# Altium project 03-425A-01A.PrjPcb (part 2 of 3)

## Sheet 425AK01A_S02.SchDoc
size A3; DocumentNumber: 2; SheetNumber: 2; SheetTotal: 10; PageSetup: Record=PageOptions|CenterHorizontal=True|CenterVertical=True|PrintScale=1.01|XCorrection=1.00|YCorrection=1.00|PrintKind=1|BorderSize=5000000|LeftOffset=0|BottomOffset=0|Orientation=2|PaperLength=1000|PaperWidth=1000|Scale=100|PaperSource=15|PrintQuality=600|MediaType=1|DitherType=10|PaperKind=A3|PrintScaleMode=1; 00_Rev: D; 00_Drawn: RJG; 00_Date: 8APR2022; 00_Checked: SR; 00_Approved: GN; 00_Line2: 100MHz Reference Select Board; 00_Line3: M4 ADS; 00_Line1: Microcontroller
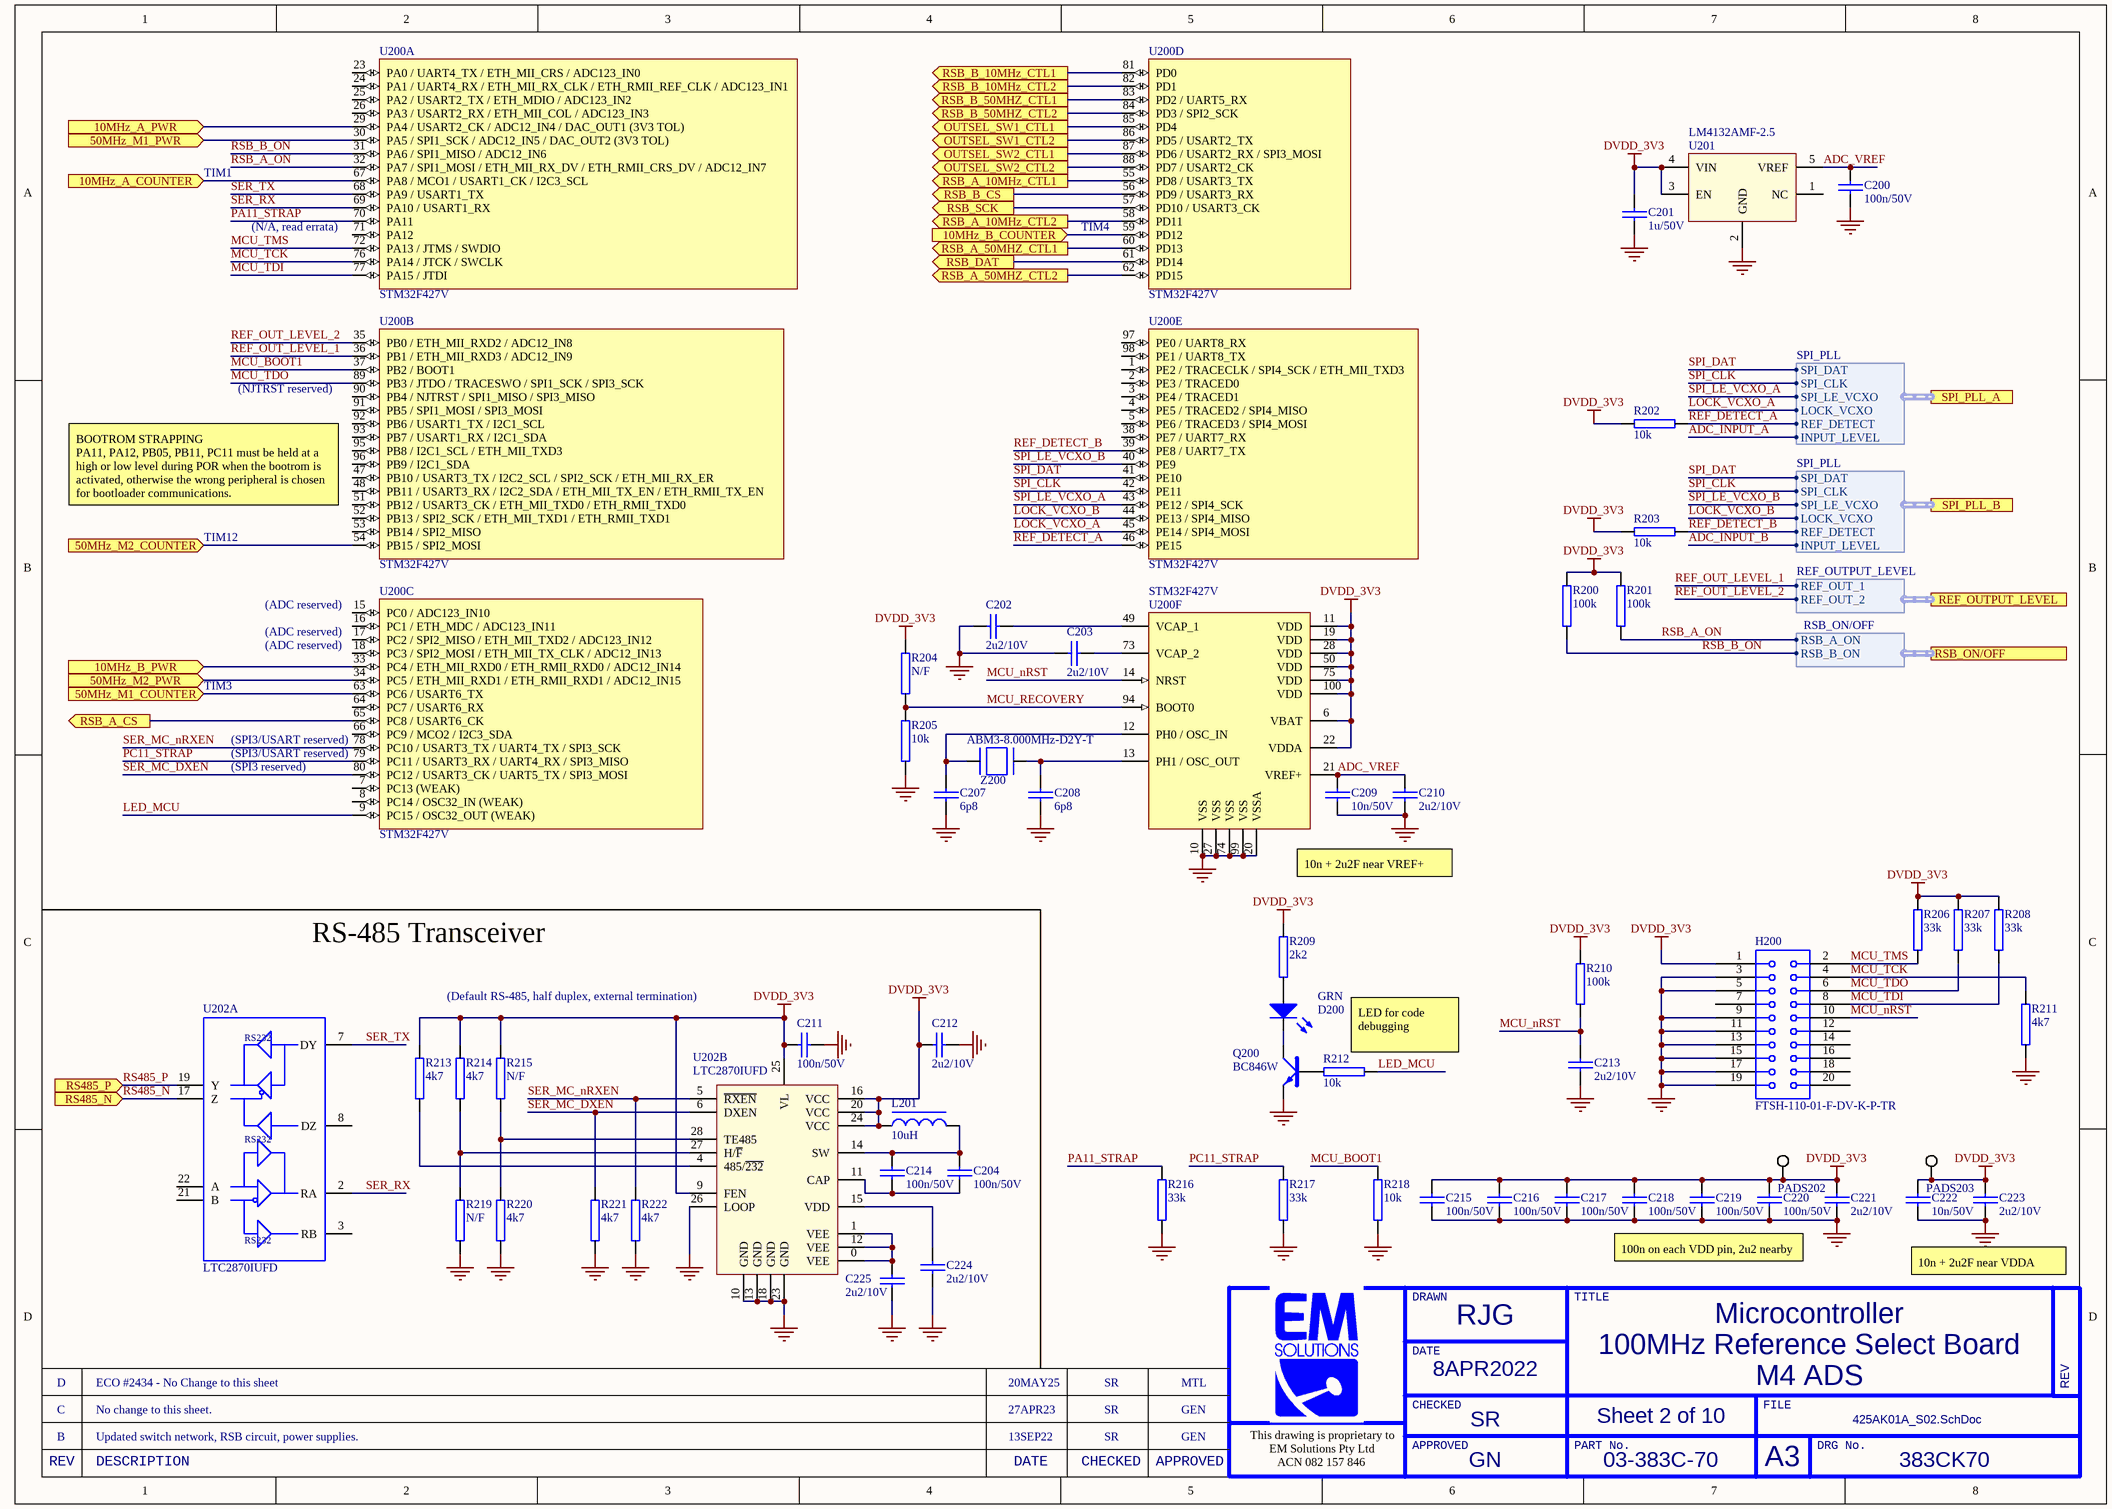
[diagram p4: 425AK01A_S02.SchDoc]

### Parts
C200  100n/50V  [0402C]
C201  1u/50V  [0603C]
C202  2u2/10V  [0603C]
C203  2u2/10V  [0603C]
C204  100n/50V  [0402C]
C207  6p8  [0402C]
C208  6p8  [0402C]
C209  10n/50V  [0402C]
C210  2u2/10V  [0603C]
C211  100n/50V  [0402C]
C212  2u2/10V  [0603C]
C213  2u2/10V  [0603C]
C214  100n/50V  [0402C]
C215  100n/50V  [0402C]
C216  100n/50V  [0402C]
C217  100n/50V  [0402C]
C218  100n/50V  [0402C]
C219  100n/50V  [0402C]
C220  100n/50V  [0402C]
C221  2u2/10V  [0603C]
C222  10n/50V  [0402C]
C223  2u2/10V  [0603C]
C224  2u2/10V  [0603C]
C225  2u2/10V  [0603C]
D200  GRN  [0603 LED]
H200  FTSH-110-01-F-DV-K-P-TR  [FTSH-110-01-F-DV-K]
L201  10uH  [0805L]
PADS202  Pads  [Pads-1x3-V3-0.3/0.6mm]  (value not drawn)  (net tie, no BOM)
PADS203  Pads  [Pads-1x3-V3-0.3/0.6mm]  (value not drawn)  (net tie, no BOM)
Q200  BC846W  [SOT-323BJT]
R200  100k  [0402]
R201  100k  [0402]
R202  10k  [0402]
R203  10k  [0402]
R204  N/F  [0402]
R205  10k  [0402]
R206  33k  [0402]
R207  33k  [0402]
R208  33k  [0402]
R209  2k2  [0402]
R210  100k  [0402]
R211  4k7  [0402]
R212  10k  [0402]
R213  4k7  [0402]
R214  4k7  [0402]
R215  N/F  [0402]
R216  33k  [0402]
R217  33k  [0402]
R218  10k  [0402]
R219  N/F  [0402]
R220  4k7  [0402]
R221  4k7  [0402]
R222  4k7  [0402]
U200  STM32F427V  [LQFP100]  (parts A,B,C,D,E,F of 6)
U201  LM4132AMF-2.5  [SOT-23/5]
U202  LTC2870IUFD  [QFN-28 4x5mm]  (parts A,B of 2)
Z200  ABM3-8.000MHz-D2Y-T  [ABM3]

### Ports
10MHz_A_COUNTER (in), 10MHz_A_PWR (in), 10MHz_B_COUNTER (in), 10MHz_B_PWR (in), 50MHz_M1_COUNTER (in), 50MHz_M1_PWR (in), 50MHz_M2_COUNTER (in), 50MHz_M2_PWR (in), OUTSEL_SW1_CTL1 (out), OUTSEL_SW1_CTL2 (out), OUTSEL_SW2_CTL1 (out), OUTSEL_SW2_CTL2 (out), REF_OUTPUT_LEVEL (harness REF_OUTPUT_LEVEL), RS485_N (in), RS485_P (in), RSB_A_10MHz_CTL1 (out), RSB_A_10MHz_CTL2 (out), RSB_A_50MHZ_CTL1 (out), RSB_A_50MHZ_CTL2 (out), RSB_A_CS (out), RSB_B_10MHz_CTL1 (out), RSB_B_10MHz_CTL2 (out), RSB_B_50MHZ_CTL1 (out), RSB_B_50MHZ_CTL2 (out), RSB_B_CS (out), RSB_DAT (out), RSB_ON/OFF (harness RSB_ON/OFF), RSB_SCK (out), SPI_PLL_A (harness SPI_PLL), SPI_PLL_B (harness SPI_PLL)

### Harnesses
SPI_PLL: SPI_LE_VCXO, SPI_CLK, SPI_DAT, REF_DETECT, LOCK_VCXO, INPUT_LEVEL
REF_OUTPUT_LEVEL: REF_OUT_1, REF_OUT_2
RSB_ON/OFF: RSB_A_ON, RSB_B_ON

### Nets
DVDD_3V3: C201.1 C211.1 C212.1 C215.1 C216.1 C217.1 C218.1 C219.1 C220.1 C221.1 C222.1 C223.1 H200.1 L201.1 PADS202.1 PADS203.1 R200.2 R201.2 R202.2 R203.2 R204.2 R206.2 R207.2 R208.2 R209.2 R210.2 R213.2 R214.2 R215.2 U200.6(VBAT) U200.11(VDD) U200.19(VDD) U200.22(VDDA) U200.28(VDD) U200.50(VDD) U200.75(VDD) U200.100(VDD) U201.3(EN) U201.4(VIN) U202.9(FEN) U202.16(VCC) U202.20(VCC) U202.24(VCC) U202.25(VL)
GND: C200.1 C201.2 C202.1 C203.2 C207.2 C208.2 C209.2 C210.2 C211.2 C212.2 C213.2 C215.2 C216.2 C217.2 C218.2 C219.2 C220.2 C221.2 C222.2 C223.2 C224.2 C225.2 H200.3 H200.5 H200.9 H200.11 H200.13 H200.15 H200.17 H200.19 Q200.E R205.1 R211.1 R216.1 R217.1 R218.1 R219.1 R220.1 R221.2 R222.1 U200.10(VSS) U200.20(VSSA) U200.27(VSS) U200.74(VSS) U200.99(VSS) U201.2(GND) U202.10(GND) U202.13(GND) U202.18(GND) U202.23(GND) U202.26(LOOP)
ADC_INPUT_A: port SPI_PLL_A.INPUT_LEVEL
ADC_INPUT_B: port SPI_PLL_B.INPUT_LEVEL
ADC_VREF: C200.2 C209.1 C210.1 U200.21(VREF+) U201.5(VREF)
LED_MCU: R212.1 U200.9(PC15_/_OSC32_OUT_(WEAK))
LOCK_VCXO_A: U200.45(PE14_/_SPI4_MOSI) ; port SPI_PLL_A.LOCK_VCXO
LOCK_VCXO_B: U200.44(PE13_/_SPI4_MISO) ; port SPI_PLL_B.LOCK_VCXO
MCU_BOOT1: R218.2 U200.37(PB2_/_BOOT1)
MCU_nRST: C213.1 H200.10 R210.1 U200.14(NRST)
MCU_RECOVERY: R204.1 R205.2 U200.94(BOOT0)
MCU_TCK: H200.4 R211.2 U200.76(PA14_/_JTCK_/_SWCLK)
MCU_TDI: H200.8 R208.1 U200.77(PA15_/_JTDI)
MCU_TDO: H200.6 R207.1 U200.89(PB3_/_JTDO_/_TRACESWO_/_SPI1_SCK_/_SPI3_SCK)
MCU_TMS: H200.2 R206.1 U200.72(PA13_/_JTMS_/_SWDIO)
PA11_STRAP: R216.2 U200.70(PA11)
PC11_STRAP: R217.2 U200.79(PC11_/_USART3_RX_/_UART4_RX_/_SPI3_MISO)
REF_DETECT_A: R202.1 U200.46(PE15) ; port SPI_PLL_A.REF_DETECT
REF_DETECT_B: R203.1 U200.39(PE8_/_UART7_TX) ; port SPI_PLL_B.REF_DETECT
REF_OUT_LEVEL_1: U200.36(PB1_/_ETH_MII_RXD3_/_ADC12_IN9) ; port REF_OUTPUT_LEVEL.REF_OUT_1
REF_OUT_LEVEL_2: U200.35(PB0_/_ETH_MII_RXD2_/_ADC12_IN8) ; port REF_OUTPUT_LEVEL.REF_OUT_2
RS485_N: U202.17(Z) ; port RS485_N
RS485_P: U202.19(Y) ; port RS485_P
RSB_A_CS: U200.65(PC8_/_USART6_CK) ; port RSB_A_CS
RSB_A_ON: R201.1 U200.32(PA7_/_SPI1_MOSI_/_ETH_MII_RX_DV_/_ETH_RMII_CRS_DV_/_ADC12_IN7) ; port RSB_ON/OFF.RSB_A_ON
RSB_B_CS: U200.56(PD9_/_USART3_RX) ; port RSB_B_CS
RSB_B_ON: R200.1 U200.31(PA6_/_SPI1_MISO_/_ADC12_IN6) ; port RSB_ON/OFF.RSB_B_ON
RSB_DAT: U200.61(PD14) ; port RSB_DAT
RSB_SCK: U200.57(PD10_/_USART3_CK) ; port RSB_SCK
SER_MC_DXEN: R221.1 U200.80(PC12_/_USART3_CK_/_UART5_TX_/_SPI3_MOSI) U202.6(DXEN)
SER_MC_nRXEN: R222.2 U200.78(PC10_/_USART3_TX_/_UART4_TX_/_SPI3_SCK) U202.5(~{RXEN})
SER_RX: U200.69(PA10_/_USART1_RX) U202.2(RA)
SER_TX: U200.68(PA9_/_USART1_TX) U202.7(DY)
SPI_CLK: U200.42(PE11) ; port SPI_PLL_A.SPI_CLK, port SPI_PLL_B.SPI_CLK
SPI_DAT: U200.41(PE10) ; port SPI_PLL_A.SPI_DAT, port SPI_PLL_B.SPI_DAT
SPI_LE_VCXO_A: U200.43(PE12_/_SPI4_SCK) ; port SPI_PLL_A.SPI_LE_VCXO
SPI_LE_VCXO_B: U200.40(PE9) ; port SPI_PLL_B.SPI_LE_VCXO
NetC202_2: C202.2 U200.49(VCAP_1)
NetC203_1: C203.1 U200.73(VCAP_2)
NetC204_1: C204.1 C214.1 U202.11(CAP)
NetC204_2: C204.2 C214.2 L201.2 U202.14(SW)
NetC207_1: C207.1 U200.12(PH0_/_OSC_IN) Z200.1
NetC208_1: C208.1 U200.13(PH1_/_OSC_OUT) Z200.2
NetC224_1: C224.1 U202.15(VDD)
NetC225_1: C225.1 U202.0(VEE) U202.1(VEE) U202.12(VEE)
NetC529_1: U200.63(PC6_/_USART6_TX) ; port 50MHz_M1_COUNTER
NetC530_1: U200.67(PA8_/_MCO1_/_USART1_CK_/_I2C3_SCL) ; port 10MHz_A_COUNTER
NetC829_1: U200.54(PB15_/_SPI2_MOSI) ; port 50MHz_M2_COUNTER
NetC830_1: U200.59(PD12) ; port 10MHz_B_COUNTER
NetD200_A: D200.A R209.1
NetD200_K: D200.K Q200.C
NetL305_2: U200.62(PD15) ; port RSB_A_50MHZ_CTL2
NetL306_2: U200.60(PD13) ; port RSB_A_50MHZ_CTL1
NetL310_2: U200.58(PD11) ; port RSB_A_10MHz_CTL2
NetL311_2: U200.55(PD8_/_USART3_TX) ; port RSB_A_10MHz_CTL1
NetL605_2: U200.84(PD3_/_SPI2_SCK) ; port RSB_B_50MHZ_CTL2
NetL606_2: U200.83(PD2_/_UART5_RX) ; port RSB_B_50MHZ_CTL1
NetL610_2: U200.82(PD1) ; port RSB_B_10MHz_CTL2
NetL611_2: U200.81(PD0) ; port RSB_B_10MHz_CTL1
NetL905_1: U200.86(PD5_/_USART2_TX) ; port OUTSEL_SW1_CTL2
NetL906_1: U200.85(PD4) ; port OUTSEL_SW1_CTL1
NetL912_1: U200.88(PD7_/_USART2_CK) ; port OUTSEL_SW2_CTL2
NetL913_1: U200.87(PD6_/_USART2_RX_/_SPI3_MOSI) ; port OUTSEL_SW2_CTL1
NetQ200_B: Q200.B R212.2
NetR213_1: R213.1 U202.4(485/~{232})
NetR214_1: R214.1 R219.2 U202.27(H/~{F})
NetR215_1: R215.1 R220.2 U202.28(TE485)
NetR316_1: U200.30(PA5_/_SPI1_SCK_/_ADC12_IN5_/_DAC_OUT2_(3V3_TOL)) ; port 50MHz_M1_PWR
NetR329_1: U200.29(PA4_/_USART2_CK_/_ADC12_IN4_/_DAC_OUT1_(3V3_TOL)) ; port 10MHz_A_PWR
NetR616_1: U200.34(PC5_/_ETH_MII_RXD1_/_ETH_RMII_RXD1_/_ADC12_IN15) ; port 50MHz_M2_PWR
NetR629_1: U200.33(PC4_/_ETH_MII_RXD0_/_ETH_RMII_RXD0_/_ADC12_IN14) ; port 10MHz_B_PWR

Not connected (* = marked no-connect by the designer): H200 7 12 14 16 18 20; U200 1(PE2_/_TRACECLK_/_SPI4_SCK_/_ETH_MII_TXD3) 2(PE3_/_TRACED0) 3(PE4_/_TRACED1) 4(PE5_/_TRACED2_/_SPI4_MISO) 5(PE6_/_TRACED3_/_SPI4_MOSI) 7(PC13_(WEAK)) 8(PC14_/_OSC32_IN_(WEAK)) 15(PC0_/_ADC123_IN10) 16(PC1_/_ETH_MDC_/_ADC123_IN11) 17(PC2_/_SPI2_MISO_/_ETH_MII_TXD2_/_ADC123_IN12) 18(PC3_/_SPI2_MOSI_/_ETH_MII_TX_CLK_/_ADC12_IN13) 23(PA0_/_UART4_TX_/_ETH_MII_CRS_/_ADC123_IN0) 24(PA1_/_UART4_RX_/_ETH_MII_RX_CLK_/_ETH_RMII_REF_CLK_/_ADC123_IN1) 25(PA2_/_USART2_TX_/_ETH_MDIO_/_ADC123_IN2) 26(PA3_/_USART2_RX_/_ETH_MII_COL_/_ADC123_IN3) 38(PE7_/_UART7_RX) 47(PB10_/_USART3_TX_/_I2C2_SCL_/_SPI2_SCK_/_ETH_MII_RX_ER) 48(PB11_/_USART3_RX_/_I2C2_SDA_/_ETH_MII_TX_EN_/_ETH_RMII_TX_EN) 51(PB12_/_USART3_CK_/_ETH_MII_TXD0_/_ETH_RMII_TXD0) 52(PB13_/_SPI2_SCK_/_ETH_MII_TXD1_/_ETH_RMII_TXD1) 53(PB14_/_SPI2_MISO) 64(PC7_/_USART6_RX) 66(PC9_/_MCO2_/_I2C3_SDA) 71(PA12) 90(PB4_/_NJTRST_/_SPI1_MISO_/_SPI3_MISO) 91(PB5_/_SPI1_MOSI_/_SPI3_MOSI) 92(PB6_/_USART1_TX_/_I2C1_SCL) 93(PB7_/_USART1_RX_/_I2C1_SDA) 95(PB8_/_I2C1_SCL_/_ETH_MII_TXD3) 96(PB9_/_I2C1_SDA) 97(PE0_/_UART8_RX) 98(PE1_/_UART8_TX); U201 1(NC); U202 3(RB) 8(DZ) 21(B) 22(A)

### Notes on the sheet
- TIM1
- (near U200) (N/A, read errata)
- (near U200) TIM4
- (near U200) (NJTRST reserved)
- (near U200) BOOTROM STRAPPING
  PA11, PA12, PB05, PB11, PC11 must be held at a
  high or low level during POR when the bootrom is
  activated, otherwise the wrong peripheral is chosen
  for bootloader communications.
- TIM12
- (near U200) (ADC reserved)
- TIM3
- (near U200) (SPI3/USART reserved)
- (SPI3 reserved)
- (near U200) 10n + 2u2F near VREF+
- RS-485 Transceiver
- (Default RS-485, half duplex, external termination)
- (near R212) LED for code debugging
- 100n on each VDD pin, 2u2 nearby
- 10n + 2u2F near VDDA
- D
- ECO #2434 - No Change to this sheet
- 20MAY25
- SR
- MTL
- B
- C
- Updated switch network, RSB circuit, power supplies.
- No change to this sheet.
- 13SEP22
- 27APR23
- GEN
- DRAWN
- TITLE
- DATE
- REV
- This drawing is proprietary to
- EM Solutions Pty Ltd
- APPROVED
- CHECKED
- PART No.
- FILE
- A3
- DRG No.
- DESCRIPTION
- ACN 082 157 846
- (in symbol 53-2870-01, part A) RS232

### Library data of the parts
C200 C215-C220 = 41-100N-13: Capacitor, 0402, 100n, X7R, 10% 50V, Ceramic; MANUFACTURER: MURATA; ID: 2441; MODELNAME: GRM155R71H104KE14J; Part Number: 41-100N-13; ItemID: 41-100N-13
C201 = 41-01U0-06: Capacitor, 0603, 1u X7R 10% 50V Ceramic, NiSn; MANUFACTURER: TAIYOYUDEN; ID: 2287; MODELNAME: UMK107AB7105KA; Part Number: 41-01U0-06; ItemID: 41-01U0-06
C202 C203 C210 C212 C213 C221 C223-C225 = 41-02U2-06: Capacitor, 0603, 2u2 X7R 10% 10V Ceramic, NiSn; MANUFACTURER: MURATA; ID: 2333; MODELNAME: GRM188R71A225KE15D; Part Number: 41-02U2-06; ItemID: 41-02U2-06
C204 C211 C214 = 41-100N-13: Capacitor, 0402, 100n, X7R, 10% 50V, Ceramic; MANUFACTURER: MURATA; MODELNAME: GRM155R71H104KE14J; ID: 2441; Part Number: 41-100N-13; ItemID: 41-100N-13
C207 C208 = 41-06P8-05: Capacitor, 0402, 6p8 NPO +/- 0.1p 50V HiQ, NiSn; MANUFACTURER: MURATA; ID: 2410; MODELNAME: GJM1555C1H6R8BB01D; Part Number: 41-06P8-05; ItemID: 41-06P8-05
C209 C222 = 41-010N-12: Capacitor, 0402, 10n X7R 10% 50V Ceramic, NiSn; MANUFACTURER: MURATA; ID: 2217; MODELNAME: GCM155R71H103KA55D; Part Number: 41-010N-12; ItemID: 41-010N-12
D200 = 57-190-01: LED, Green, 0603, 35mcd @ 20mA; MANUFACTURER: LIGHTON; ID: 3517; MODELNAME: LTST-C190KGKT; Part Number: 57-190-01; ItemID: 57-190-01
H200 = 20-H20-04: PCB Header, 10+10way, 1.27mm, Polarised, SMD, Pick and Place; MANUFACTURER: SAMTEC; ID: 1947; Part Number: 20-H20-04; ItemID: 20-H20-04; MODELNAME: FTSH-110-01-F-DV-K-P-TR
L201 = 46-010U-03: Inductor, Chip, 10uH 20%, SRF=50MHz, 0805 MLZ series; MANUFACTURER: TDK; ID: 3129; MODELNAME: MLZ2012M100WT000; Part Number: 46-010U-03; ItemID: 46-010U-03
PADS202 PADS203 = Pads: Cluster of pads
Q200 = 62-BC846-01: Transistor, NPN Si, GenPur 65V 100mA, SOT-323; MANUFACTURER: TAIWAN SEMI; MODELNAME: BC846CW RF; ID: 3683; Part Number: 62-BC846-01; ItemID: 62-BC846-01
R200 R201 R210 = 44-100K-10: Resistor, 0402, 100k 1% 0.063W; MANUFACTURER: PHILIPS; ID: 2931; MODELNAME: RC32H; Part Number: 44-100K-10; ItemID: 44-100K-10
R202 R203 R205 R212 R218 = 44-010K-10: Resistor, 0402, 10k 1% 0.063W; MANUFACTURER: PHILIPS; ID: 2542; MODELNAME: RC0402FR-0710KL; Part Number: 44-010K-10; ItemID: 44-010K-10
R204 = 44-N/F-10: Resistor, 0402, SOT, Not Fitted; ID: 3111; Part Number: 44-N/F-10; ItemID: 44-N/F-10
R206-R208 R216 R217 = 44-033K-10: Resistor, 0402, 33k 1% 0.063W; MANUFACTURER: PHILIPS; ID: 2720; MODELNAME: RC32H; Part Number: 44-033K-10; ItemID: 44-033K-10
R209 = 44-02K2-10: Resistor, 0402, 2k2 1% 0.063W; MANUFACTURER: PHILIPS; ID: 2688; MODELNAME: RC32H; Part Number: 44-02K2-10; ItemID: 44-02K2-10
R211 = 44-04K7-10: Resistor, 0402, 4k7 1% 0.063W; MANUFACTURER: PHILIPS; ID: 2794; MODELNAME: ERJ-2RKF4701X; Part Number: 44-04K7-10; ItemID: 44-04K7-10
R213 R220-R222 = 44-04K7-10: Resistor, 0402, 4k7 1% 0.063W; MANUFACTURER: PHILIPS; MODELNAME: ERJ-2RKF4701X; ID: 2794; Part Number: 44-04K7-10; ItemID: 44-04K7-10
R214 = 44-04K7-10: Resistor, 0402, 4k7 1% 0.063W; MANUFACTURER: GENERIC; ID: 2794; Part Number: 44-04K7-10; MODELNAME: GENERIC; ItemID: 44-04K7-10
R215 R219 = 44-N/F-10: Resistor,0402,SOT,Not Fitted; MANUFACTURER: PHILIPS; MODELNAME: RC32H; ID: 3111; Part Number: 44-N/F-10; ItemID: 44-N/F-10
U200 = 51-32F427-01: Microcontroller, ARM, 32b, 180MHz, 2M Flash, 3V, Ethernet, LQFP100; MANUFACTURER: ST; ID: 3306; MODELNAME: STM32F427VIT6; Part Number: 51-32F427-01; ItemID: 51-32F427-01
U201 = 52-4132-02: Voltage Ref, 2.5V +/-0.05%, 20ppm/degC, -40/+125degC, SOT-23/5; MANUFACTURER: TI; ID: 3377; MODELNAME: LM4132AMF-2.5/NOPB; Part Number: 52-4132-02; ItemID: 52-4132-02
U202 = 53-2870-01: Transceiver RS422/485/RS232, 3V, ESD, -40/+85, QFN28; MANUFACTURER: LIN TECH; MODELNAME: LTC2870IUFD#PBF; ID: 3442; Part Number: 53-2870-01; ItemID: 53-2870-01
Z200 = 37-0102: Cryst, 8.00MHz, +/-30ppm -40/+85, +/-20ppmCal, 18pF, SMD5x3.2; ID: 2114; Part Number: 37-0102; ItemID: 37-0102; MODELNAME: ABM3-8.000MHz-D2Y-T

## Sheet 425AK01A_S10.SchDoc
size A3; DocumentNumber: 10; SheetNumber: 10; SheetTotal: 10; PageSetup: Record=PageOptions|CenterHorizontal=True|CenterVertical=True|PrintScale=1.01|XCorrection=1.00|YCorrection=1.00|PrintKind=1|BorderSize=5000000|LeftOffset=0|BottomOffset=0|Orientation=2|PaperLength=1000|PaperWidth=1000|Scale=100|PaperSource=15|PrintQuality=600|MediaType=1|DitherType=10|PaperKind=A3|PrintScaleMode=1; 00_Rev: D; 00_Drawn: RJG; 00_Date: 8APR2022; 00_Checked: SR; 00_Approved: GN; 00_Line2: 100MHz Reference Select Board; 00_Line3: M4 ADS; 00_Line1: PSUs
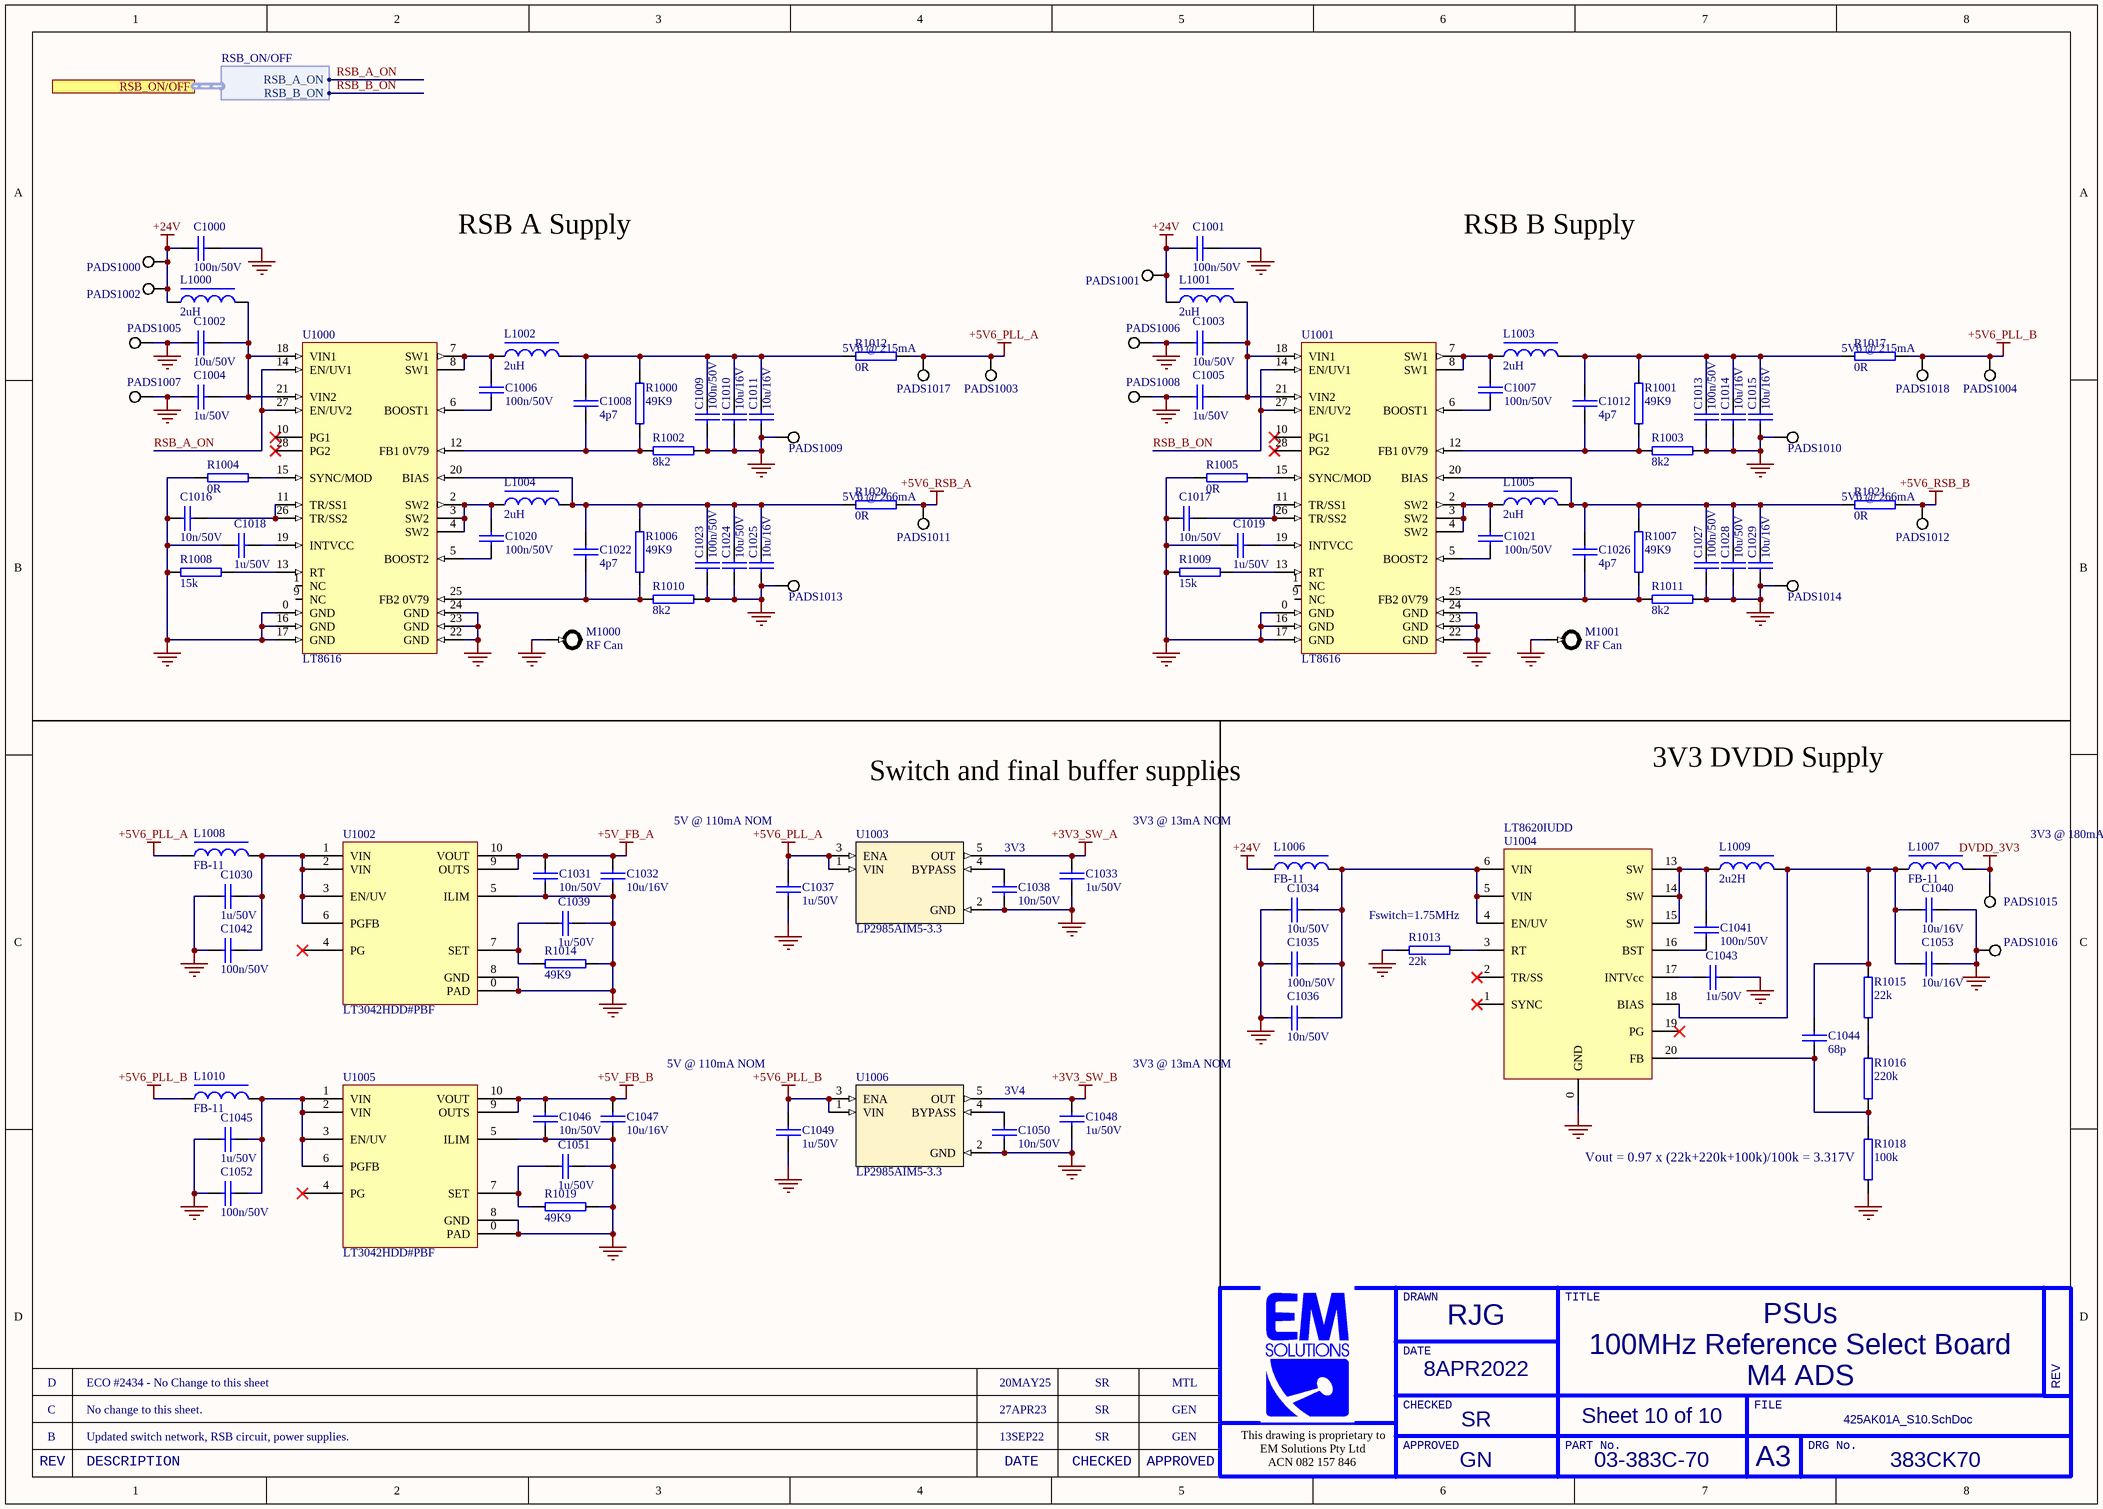
[diagram p5: 425AK01A_S10.SchDoc]

### Parts
C1000  100n/50V  [0402C]
C1001  100n/50V  [0402C]
C1002  10u/50V  [1206C]
C1003  10u/50V  [1206C]
C1004  1u/50V  [0603C]
C1005  1u/50V  [0603C]
C1006  100n/50V  [0402C]
C1007  100n/50V  [0402C]
C1008  4p7  [0402C]
C1009  100n/50V  [0402C]
C1010  10u/16V  [0805C]
C1011  10u/16V  [0805C]
C1012  4p7  [0402C]
C1013  100n/50V  [0402C]
C1014  10u/16V  [0805C]
C1015  10u/16V  [0805C]
C1016  10n/50V  [0402C]
C1017  10n/50V  [0402C]
C1018  1u/50V  [0603C]
C1019  1u/50V  [0603C]
C1020  100n/50V  [0402C]
C1021  100n/50V  [0402C]
C1022  4p7  [0402C]
C1023  100n/50V  [0402C]
C1024  10u/50V  [1206C]
C1025  10u/16V  [0805C]
C1026  4p7  [0402C]
C1027  100n/50V  [0402C]
C1028  10u/50V  [1206C]
C1029  10u/16V  [0805C]
C1030  1u/50V  [0603C]
C1031  10n/50V  [0402C]
C1032  10u/16V  [0805C]
C1033  1u/50V  [0603C]
C1034  10u/50V  [1206C]
C1035  100n/50V  [0402C]
C1036  10n/50V  [0402C]
C1037  1u/50V  [0603C]
C1038  10n/50V  [0402C]
C1039  1u/50V  [0603C]
C1040  10u/16V  [0805C]
C1041  100n/50V  [0402C]
C1042  100n/50V  [0402C]
C1043  1u/50V  [0603C]
C1044  68p  [0402C]
C1045  1u/50V  [0603C]
C1046  10n/50V  [0402C]
C1047  10u/16V  [0805C]
C1048  1u/50V  [0603C]
C1049  1u/50V  [0603C]
C1050  10n/50V  [0402C]
C1051  1u/50V  [0603C]
C1052  100n/50V  [0402C]
C1053  10u/16V  [0805C]
L1000  2uH  [XFL4030]
L1001  2uH  [XFL4030]
L1002  2uH  [XFL4030]
L1003  2uH  [XFL4030]
L1004  2uH  [XFL4030]
L1005  2uH  [XFL4030]
L1006  FB-11  [0402L]
L1007  FB-11  [0402L]
L1008  FB-11  [0402L]
L1009  2u2H  [0805L]
L1010  FB-11  [0402L]
M1000  RF Can  [Can_38x25.4x6mm]
M1001  RF Can  [Can_38x25.4x6mm]
PADS1000  Pads  [Pads-1x3-V3-0.3/0.6mm]  (value not drawn)  (net tie, no BOM)
PADS1001  Pads  [Pads-1x3-V3-0.3/0.6mm]  (value not drawn)  (net tie, no BOM)
PADS1002  Pads  [Pads-1x3-V3-0.3/0.6mm]  (value not drawn)  (net tie, no BOM)
PADS1003  Pads  [Pads-1x3-V3-0.3/0.6mm]  (value not drawn)  (net tie, no BOM)
PADS1004  Pads  [Pads-1x3-V3-0.3/0.6mm]  (value not drawn)  (net tie, no BOM)
PADS1005  Pads  [Pads-1x3-V3-0.3/0.6mm]  (value not drawn)  (net tie, no BOM)
PADS1006  Pads  [Pads-1x3-V3-0.3/0.6mm]  (value not drawn)  (net tie, no BOM)
PADS1007  Pads  [Pads-1x3-V3-0.3/0.6mm]  (value not drawn)  (net tie, no BOM)
PADS1008  Pads  [Pads-1x3-V3-0.3/0.6mm]  (value not drawn)  (net tie, no BOM)
PADS1009  Pads  [Pads-1x3-V3-0.3/0.6mm]  (value not drawn)  (net tie, no BOM)
PADS1010  Pads  [Pads-1x3-V3-0.3/0.6mm]  (value not drawn)  (net tie, no BOM)
PADS1011  Pads  [Pads-1x3-V3-0.3/0.6mm]  (value not drawn)  (net tie, no BOM)
PADS1012  Pads  [Pads-1x3-V3-0.3/0.6mm]  (value not drawn)  (net tie, no BOM)
PADS1013  Pads  [Pads-1x3-V3-0.3/0.6mm]  (value not drawn)  (net tie, no BOM)
PADS1014  Pads  [Pads-1x3-V3-0.3/0.6mm]  (value not drawn)  (net tie, no BOM)
PADS1015  Pads  [Pads-1x3-V3-0.3/0.6mm]  (value not drawn)  (net tie, no BOM)
PADS1016  Pads  [Pads-1x3-V3-0.3/0.6mm]  (value not drawn)  (net tie, no BOM)
PADS1017  Pads  [Pads-1x3-V3-0.3/0.6mm]  (value not drawn)  (net tie, no BOM)
PADS1018  Pads  [Pads-1x3-V3-0.3/0.6mm]  (value not drawn)  (net tie, no BOM)
R1000  49K9  [0402]
R1001  49K9  [0402]
R1002  8k2  [0402]
R1003  8k2  [0402]
R1004  0R  [0402]
R1005  0R  [0402]
R1006  49K9  [0402]
R1007  49K9  [0402]
R1008  15k  [0402]
R1009  15k  [0402]
R1010  8k2  [0402]
R1011  8k2  [0402]
R1012  0R  [0402]
R1013  22k  [0402]
R1014  49K9  [0402]
R1015  22k  [0402]
R1016  220k  [0402]
R1017  0R  [0402]
R1018  100k  [0402]
R1019  49K9  [0402]
R1020  0R  [0402]
R1021  0R  [0402]
U1000  LT8616  [QFN28-6x3mm]
U1001  LT8616  [QFN28-6x3mm]
U1002  LT3042HDD#PBF  [DFN50P300X300X80_HS-11N]
U1003  LP2985AIM5-3.3  [SOT-23/5]
U1004  LT8620IUDD  [QFN24-5x3mm]
U1005  LT3042HDD#PBF  [DFN50P300X300X80_HS-11N]
U1006  LP2985AIM5-3.3  [SOT-23/5]

### Ports
RSB_ON/OFF (harness RSB_ON/OFF)

### Harnesses
RSB_ON/OFF: RSB_A_ON, RSB_B_ON

### Nets
+3V3_SW_A: C1033.2 U1003.5(OUT)
+3V3_SW_B: C1048.2 U1006.5(OUT)
+5V6_PLL_A: C1037.2 L1008.2 PADS1003.1 PADS1017.1 R1012.1 U1003.1(VIN) U1003.3(ENA)
+5V6_PLL_B: C1049.2 L1010.2 PADS1004.1 PADS1018.1 R1017.1 U1006.1(VIN) U1006.3(ENA)
+5V6_RSB_A: PADS1011.1 R1020.1
+5V6_RSB_B: PADS1012.1 R1021.1
+5V_FB_A: C1031.2 C1032.1 U1002.9(OUTS) U1002.10(VOUT)
+5V_FB_B: C1046.2 C1047.1 U1005.9(OUTS) U1005.10(VOUT)
+24V: C1000.1 C1001.1 L1000.1 L1001.1 L1006.1 PADS1000.1 PADS1001.1 PADS1002.1
DVDD_3V3: L1007.2 PADS1015.1
GND: C1000.2 C1001.2 C1002.1 C1003.1 C1004.1 C1005.1 C1009.2 C1010.1 C1011.2 C1013.2 C1014.1 C1015.2 C1016.1 C1017.1 C1018.1 C1019.1 C1023.2 C1024.1 C1025.2 C1027.2 C1028.1 C1029.2 C1030.1 C1031.1 C1032.2 C1033.1 C1034.2 C1035.2 C1036.2 C1037.1 C1038.1 C1039.2 C1040.2 C1042.2 C1043.2 C1045.1 C1046.1 C1047.2 C1048.1 C1049.1 C1050.1 C1051.2 C1052.2 C1053.2 M1000.0 M1001.0 PADS1005.1 PADS1006.1 PADS1007.1 PADS1008.1 PADS1009.1 PADS1010.1 PADS1013.1 PADS1014.1 PADS1016.1 R1002.1 R1003.1 R1004.2 R1005.2 R1008.2 R1009.2 R1010.1 R1011.1 R1013.2 R1014.1 R1018.1 R1019.1 U1000.0(GND) U1000.16(GND) U1000.17(GND) U1000.22(GND) U1000.23(GND) U1000.24(GND) U1001.0(GND) U1001.16(GND) U1001.17(GND) U1001.22(GND) U1001.23(GND) U1001.24(GND) U1002.0(PAD) U1002.5(ILIM) U1002.8(GND) U1003.2(GND) U1004.0(GND) U1004.8(GND) U1004.9(GND) U1004.10(NC) U1004.11(NC) U1004.12(NC) U1004.21(NC) U1004.22(NC) U1004.23(NC) U1004.24(NC) U1005.0(PAD) U1005.5(ILIM) U1005.8(GND) U1006.2(GND)
RSB_A_ON: U1000.14(EN/UV1) U1000.27(EN/UV2) ; port RSB_ON/OFF.RSB_A_ON
RSB_B_ON: U1001.14(EN/UV1) U1001.27(EN/UV2) ; port RSB_ON/OFF.RSB_B_ON
NetC1002_2: C1002.2 C1004.2 L1000.2 U1000.18(VIN1) U1000.21(VIN2)
NetC1003_2: C1003.2 C1005.2 L1001.2 U1001.18(VIN1) U1001.21(VIN2)
NetC1006_1: C1006.1 L1002.1 U1000.7(SW1) U1000.8(SW1)
NetC1006_2: C1006.2 U1000.6(BOOST1)
NetC1007_1: C1007.1 L1003.1 U1001.7(SW1) U1001.8(SW1)
NetC1007_2: C1007.2 U1001.6(BOOST1)
NetC1008_1: C1008.1 C1009.1 C1010.2 C1011.1 L1002.2 R1000.2 R1012.2
NetC1008_2: C1008.2 R1000.1 R1002.2 U1000.12(FB1_0V79)
NetC1012_1: C1012.1 C1013.1 C1014.2 C1015.1 L1003.2 R1001.2 R1017.2
NetC1012_2: C1012.2 R1001.1 R1003.2 U1001.12(FB1_0V79)
NetC1016_2: C1016.2 U1000.11(TR/SS1) U1000.26(TR/SS2)
NetC1017_2: C1017.2 U1001.11(TR/SS1) U1001.26(TR/SS2)
NetC1018_2: C1018.2 U1000.19(INTVCC)
NetC1019_2: C1019.2 U1001.19(INTVCC)
NetC1020_1: C1020.1 L1004.1 U1000.2(SW2) U1000.3(SW2) U1000.4(SW2)
NetC1020_2: C1020.2 U1000.5(BOOST2)
NetC1021_1: C1021.1 L1005.1 U1001.2(SW2) U1001.3(SW2) U1001.4(SW2)
NetC1021_2: C1021.2 U1001.5(BOOST2)
NetC1022_1: C1022.1 C1023.1 C1024.2 C1025.1 L1004.2 R1006.2 R1020.2 U1000.20(BIAS)
NetC1022_2: C1022.2 R1006.1 R1010.2 U1000.25(FB2_0V79)
NetC1026_1: C1026.1 C1027.1 C1028.2 C1029.1 L1005.2 R1007.2 R1021.2 U1001.20(BIAS)
NetC1026_2: C1026.2 R1007.1 R1011.2 U1001.25(FB2_0V79)
NetC1030_2: C1030.2 C1042.1 L1008.1 U1002.1(VIN) U1002.2(VIN) U1002.3(EN/UV) U1002.6(PGFB)
NetC1034_1: C1034.1 C1035.1 C1036.1 L1006.2 U1004.4(EN/UV) U1004.5(VIN) U1004.6(VIN)
NetC1038_2: C1038.2 U1003.4(BYPASS)
NetC1039_1: C1039.1 R1014.2 U1002.7(SET)
NetC1040_1: C1040.1 C1044.2 C1053.1 L1007.1 L1009.2 R1015.2 U1004.18(BIAS)
NetC1041_1: C1041.1 U1004.16(BST)
NetC1041_2: C1041.2 L1009.1 U1004.13(SW) U1004.14(SW) U1004.15(SW)
NetC1043_1: C1043.1 U1004.17(INTVcc)
NetC1044_1: C1044.1 R1016.1 R1018.2 U1004.20(FB)
NetC1045_2: C1045.2 C1052.1 L1010.1 U1005.1(VIN) U1005.2(VIN) U1005.3(EN/UV) U1005.6(PGFB)
NetC1050_2: C1050.2 U1006.4(BYPASS)
NetC1051_1: C1051.1 R1019.2 U1005.7(SET)
NetR1004_1: R1004.1 U1000.15(SYNC/MOD)
NetR1005_1: R1005.1 U1001.15(SYNC/MOD)
NetR1008_1: R1008.1 U1000.13(RT)
NetR1009_1: R1009.1 U1001.13(RT)
NetR1013_1: R1013.1 U1004.3(RT)
NetR1015_1: R1015.1 R1016.2

Not connected (* = marked no-connect by the designer): U1000 1(NC) 9(NC) 10(PG1)* 28(PG2)*; U1001 1(NC) 9(NC) 10(PG1)* 28(PG2)*; U1002 4(PG)*; U1004 1(SYNC)* 2(TR/SS)* 7(NC) 19(PG)*; U1005 4(PG)*

### Notes on the sheet
- RSB A Supply
- RSB B Supply
- (near R1012) 5V6 @ 215mA
- (near R1017) 5V6 @ 215mA
- (near R1020) 5V6 @ 266mA
- (near R1021) 5V6 @ 266mA
- Switch and final buffer supplies
- 3V3 DVDD Supply
- 5V @ 110mA NOM
- 3V3
- (near C1033) 3V3 @ 13mA NOM
- (near L1007) 3V3 @ 180mA
- Fswitch=1.75MHz
- 3V4
- (near C1048) 3V3 @ 13mA NOM
- (near R1018) Vout = 0.97 x (22k+220k+100k)/100k = 3.317V
- D
- ECO #2434 - No Change to this sheet
- 20MAY25
- SR
- MTL
- B
- C
- Updated switch network, RSB circuit, power supplies.
- No change to this sheet.
- 13SEP22
- 27APR23
- GEN
- DRAWN
- TITLE
- DATE
- REV
- This drawing is proprietary to
- EM Solutions Pty Ltd
- APPROVED
- CHECKED
- PART No.
- FILE
- A3
- DRG No.
- DESCRIPTION
- ACN 082 157 846

### Library data of the parts
C1000 C1001 C1006 C1007 C1009 C1013 C1020 C1021 C1023 C1027 C1035 = 41-100N-13: as C204 on sheet 425AK01A_S02; Part Number: 41-100N-13; ItemID: 41-100N-13
C1002 C1003 C1024 C1028 = 41-010U-13: Capacitor, 1206, 10u X7R 10% 50V Ceramic, NiSn; MANUFACTURER: SAMSUNG; ID: 2237; MODELNAME: CL31B106KBHNNNE; Part Number: 41-010U-13; ItemID: 41-010U-13
C1004 C1005 C1018 C1019 = 41-01U0-06: as C201 on sheet 425AK01A_S02; Part Number: 41-01U0-06; ItemID: 41-01U0-06
C1008 C1012 C1022 C1026 = 41-04P7-05: Capacitor, 0402, 4p7 NPO +/-0.1p 50V Ceramic, NiSn, Low ESR; MANUFACTURER: AVX; ID: 2381; MODELNAME: 04025U4R7BAT2A; Part Number: 41-04P7-05; ItemID: 41-04P7-05
C1010 C1011 C1014 C1015 C1025 C1029 C1032 C1040 C1047 C1053 = 41-010U-08: Capacitor, 0805, 10u X7R 10% 16V Ceramic, NiSn; MANUFACTURER: SAMSUNG; ID: 2232; MODELNAME: CL21B106KOQNNNE; Part Number: 41-010U-08; ItemID: 41-010U-08
C1016 C1017 C1031 C1038 C1046 C1050 = 41-010N-12: as C209 on sheet 425AK01A_S02; Part Number: 41-010N-12; ItemID: 41-010N-12
C1030 C1033 C1037 C1039 C1043 C1045 C1048 C1049 C1051 = 41-01U0-06: Capacitor, 0603, 1u X7R 10% 50V Ceramic, NiSn; MANUFACTURER: TAIYOYUDEN; MODELNAME: UMK107AB7105KA; ID: 2287; Part Number: 41-01U0-06; ItemID: 41-01U0-06
C1034 = 41-010U-13: Capacitor, 1206, 10u X7R 10% 50V Ceramic, NiSn; MANUFACTURER: SAMSUNG; MODELNAME: CL31B106KBHNNNE; ID: 2237; Part Number: 41-010U-13; ItemID: 41-010U-13
C1036 = 41-010N-12: Capacitor, 0402, 10n X7R 10% 50V Ceramic, NiSn; MANUFACTURER: MURATA; MODELNAME: GCM155R71H103KA55D; ID: 2217; Part Number: 41-010N-12; ItemID: 41-010N-12
C1041 C1042 C1052 = 41-100N-13: as C200 on sheet 425AK01A_S02; Part Number: 41-100N-13; ItemID: 41-100N-13
C1044 = 41-068P-08: Capacitor, 0402, 68p NPO 2% 50V Ceramic, NiSn; MANUFACTURER: MURATA; ID: 4027; MODELNAME: GRM1555C1H680GA01D; Part Number: 41-068P-08; ItemID: 41-068P-08
L1000-L1005 = Inductor 2uH 46-02U0-01: Inductor, 2uH 20% 0.011R 2.5A, 4x4mm Shield, XFL4030 Ser; MANUFACTURER: COILCRAFT; ID: 3146; MODELNAME: XFL4030-202MEC; Part Number: 46-02U0-01; ItemID: 46-02U0-01
L1006-L1008 L1010 = 46-B-11: Solid Inductor, 600ohm@100MHz, DCR=0.52, 0.3A, 0402 size; MANUFACTURER: TDK; MODELNAME: MMZ1005S601C; ID: 3256; Part Number: 46-B-11; ItemID: 46-B-11
L1009 = 46-02U2-01: Inductor, Chip, 2u2H 10%, 0805, SIMID08B Series; MANUFACTURER: EPCOS; MODELNAME: B82498F1222J000; ID: 3171; Part Number: 46-02U2-01; ItemID: 46-02U2-01
M1000 M1001 = Can-RF: Part Number: 11-0256
PADS1000-PADS1018 = Pads: Cluster of pads
R1000 R1001 R1006 R1007 = 44-49K9-01: Resistor, 0402, 49.9K, 1%, 0.1W, ThickFilm, AEC-Q200; MANUFACTURER: PANASONIC; ID: 3061; MODELNAME: ERJ-2RKF4992X; Part Number: 44-49K9-01; ItemID: 44-49K9-01
R1002 R1003 R1010 R1011 = 44-08K2-10: Resistor, 0402, 8k2 1% 0.063W; MANUFACTURER: GENERIC; ID: 2891; Part Number: 44-08K2-10; ItemID: 44-08K2-10; MODELNAME: GENERIC
R1004 R1005 R1012 R1017 R1020 R1021 = 44-000R-10: Resistor, 0402, 0R 1% 0.063W; MANUFACTURER: PHILIPS; ID: 2538; MODELNAME: CRG0402ZR; Part Number: 44-000R-10; ItemID: 44-000R-10
R1008 R1009 = 44-015K-10: Resistor, 0402, 15k 1% 0.063W; MANUFACTURER: GENERIC; ID: 2575; Part Number: 44-015K-10; ItemID: 44-015K-10; MODELNAME: GENERIC
R1013 = 44-022K-10: Resistor, 0402, 22k 1% 0.063W; MANUFACTURER: PHILIPS; MODELNAME: RC32H; ID: 2661; Part Number: 44-022K-10; ItemID: 44-022K-10
R1014 R1019 = 44-49K9-01: Resistor, 0402, 49.9K, 1%, 0.1W, ThickFilm, AEC-Q200; MANUFACTURER: PANASONIC; MODELNAME: ERJ-2RKF4992X; ID: 3061; Part Number: 44-49K9-01; ItemID: 44-49K9-01
R1015 = 44-022K-10: Resistor, 0402, 22k 1% 0.063W; MANUFACTURER: GENERIC; ID: 2661; Part Number: 44-022K-10; ItemID: 44-022K-10; MODELNAME: GENERIC
R1016 = 44-220K-10: Resistor, 0402, 220k 1% 0.063W; MANUFACTURER: PHILIPS; MODELNAME: RC32H; ID: 2994; Part Number: 44-220K-10; ItemID: 44-220K-10
R1018 = 44-100K-10: Resistor, 0402, 100k 1% 0.063W; MANUFACTURER: GENERIC; ID: 2931; Part Number: 44-100K-10; MODELNAME: GENERIC; ItemID: 44-100K-10
U1000 U1001 = LT8616EUDE: Dual SMPS, 3.4-42V, QFN28, high efficiency, 1.5A/2.5A output; Part Number: 54-8616-02
U1002 U1005 = 52-3042-01: Volt Regulator, Vin=1.8-20V, Vin=0-15V, 200mA, Low Noise, -40to+125C; MANUFACTURER: ANLG DEV; MODELNAME: LT3042IDD#PBF; ID: 3361; Part Number: 52-3042-01; ItemID: 52-3042-01
U1003 U1006 = Regulator-Linear-3V3-LP2985: Volt Regulator, 3.3V, 150mA, LoNoise, LDO, SOT-23/5; Part Number: 52-2985-06; MPN: LP2985AIM5-3.3/NOPB; Manufacturer: Texas Instruments
U1004 = 54-8620-01: *Switching Reg, Dual, 3.4V-65Vin, -40/125C, QFN24 3x5mm; MANUFACTURER: LIN TECH; MODELNAME: LT8620IUDD#PBF; ID: 3510; Part Number: 54-8620-01; ItemID: 54-8620-01

## Sheet 425AK01A_S03.SchDoc
size A3; DocumentNumber: 3; SheetNumber: 3; SheetTotal: 10; PageSetup: Record=PageOptions|CenterHorizontal=True|CenterVertical=True|PrintScale=1.01|XCorrection=1.00|YCorrection=1.00|PrintKind=1|BorderSize=5000000|LeftOffset=0|BottomOffset=0|Orientation=2|PaperLength=1000|PaperWidth=1000|Scale=100|PaperSource=15|PrintQuality=600|MediaType=1|DitherType=10|PaperKind=A3|PrintScaleMode=1; 00_Rev: D; 00_Drawn: RJG; 00_Date: 11AUG2022; 00_Checked: SR; 00_Approved: GN; 00_Line1: RSB A 10MHz/50MHz Input Paths; 00_Line2: 100MHz Reference Select Board; 00_Line3: M4 ADS
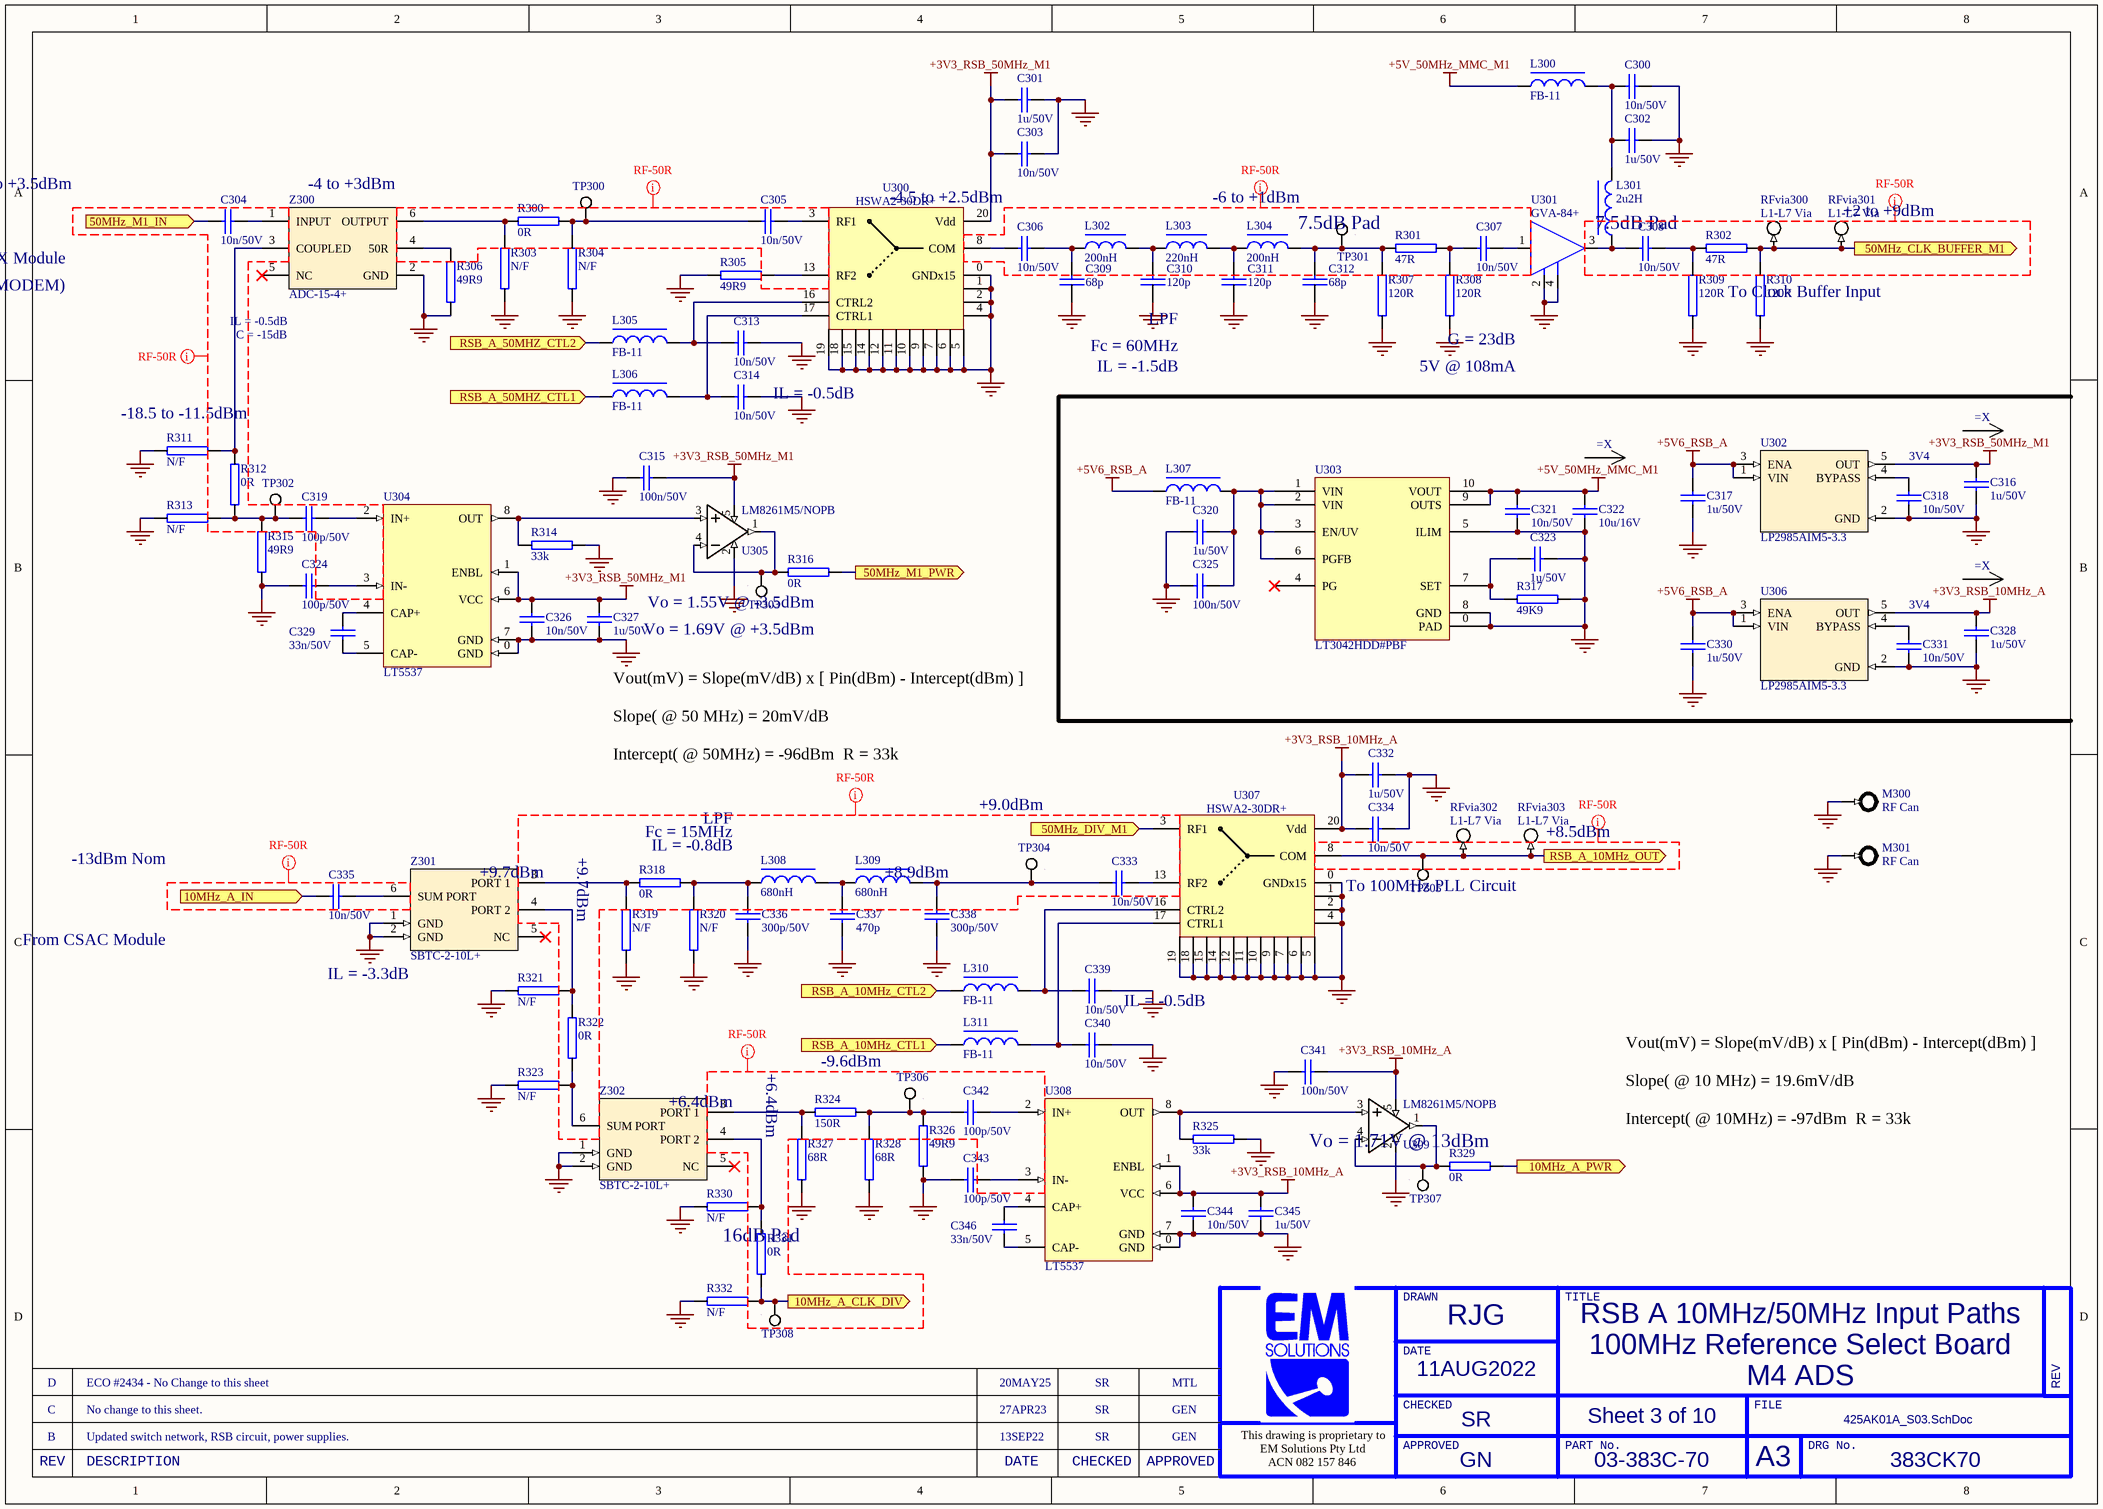
[diagram p6: 425AK01A_S03.SchDoc]

### Parts
(Parts that share a designator on the sheet are numbered #1, #2 ... from top to bottom, then left to right.)
C300  10n/50V  [0402C]
C301  1u/50V  [0603C]
C302  1u/50V  [0603C]
C303  10n/50V  [0402C]
C304  10n/50V  [0402C]
C305  10n/50V  [0402C]
C306  10n/50V  [0402C]
C307  10n/50V  [0402C]
C308  10n/50V  [0402C]
C309  68p  [0402C]
C310  120p  [0402C]
C311  120p  [0402C]
C312  68p  [0402C]
C313  10n/50V  [0402C]
C314  10n/50V  [0402C]
C315  100n/50V  [0402C]
C316  1u/50V  [0603C]
C317  1u/50V  [0603C]
C318  10n/50V  [0402C]
C319  100p/50V  [0402C]
C320  1u/50V  [0603C]
C321  10n/50V  [0402C]
C322  10u/16V  [0805C]
C323  1u/50V  [0603C]
C324  100p/50V  [0402C]
C325  100n/50V  [0402C]
C326  10n/50V  [0402C]
C327  1u/50V  [0603C]
C328  1u/50V  [0603C]
C329  33n/50V  [0402C]
C330  1u/50V  [0603C]
C331  10n/50V  [0402C]
C332  1u/50V  [0603C]
C333  10n/50V  [0402C]
C334  10n/50V  [0402C]
C335  10n/50V  [0402C]
C336  300p/50V  [0402C]
C337  470p  [0402C]
C338  300p/50V  [0402C]
C339  10n/50V  [0402C]
C340  10n/50V  [0402C]
C341  100n/50V  [0402C]
C342  100p/50V  [0402C]
C343  100p/50V  [0402C]
C344  10n/50V  [0402C]
C345  1u/50V  [0603C]
C346  33n/50V  [0402C]
GA?#1  13mA  (value not drawn)  (graphical)
GA?#2  108mA  (value not drawn)  (graphical)
GA?#3  13mA  (value not drawn)  (graphical)
L300  FB-11  [0402L]
L301  2u2H  [0805L]
L302  200nH  [0402L]
L303  220nH  [0402L]
L304  200nH  [0402L]
L305  FB-11  [0402L]
L306  FB-11  [0402L]
L307  FB-11  [0402L]
L308  680nH  [0603L]
L309  680nH  [0603L]
L310  FB-11  [0402L]
L311  FB-11  [0402L]
M300  RF Can  [Can_38x25.4x6mm]
M301  RF Can  [Can_38x25.4x6mm]
R300  0R  [0402]
R301  47R  [0402]
R302  47R  [0402]
R303  N/F  [0402]
R304  N/F  [0402]
R305  49R9  [0402]
R306  49R9  [0402]
R307  120R  [0402]
R308  120R  [0402]
R309  120R  [0402]
R310  120R  [0402]
R311  N/F  [0402]
R312  0R  [0402]
R313  N/F  [0402]
R314  33k  [0402]
R315  49R9  [0402]
R316  0R  [0402]
R317  49K9  [0402]
R318  0R  [0402]
R319  N/F  [0402]
R320  N/F  [0402]
R321  N/F  [0402]
R322  0R  [0402]
R323  N/F  [0402]
R324  150R  [0402]
R325  33k  [0402]
R326  49R9  [0402]
R327  68R  [0402]
R328  68R  [0402]
R329  0R  [0402]
R330  N/F  [0402]
R331  0R  [0402]
R332  N/F  [0402]
RFvia300  L1-L7 Via  [RFvia_L1-L7]  (no BOM)
RFvia301  L1-L7 Via  [RFvia_L1-L7]  (no BOM)
RFvia302  L1-L7 Via  [RFvia_L1-L7]  (no BOM)
RFvia303  L1-L7 Via  [RFvia_L1-L7]  (no BOM)
TP300  Pad  [Testpoint-0.5mm-SMT-withPaste]  (value not drawn)  (no BOM)
TP301  Pad  [Testpoint-0.5mm-SMT-withPaste]  (value not drawn)  (no BOM)
TP302  Pad  [Testpoint-0.5mm-SMT-withPaste]  (value not drawn)  (no BOM)
TP303  Pad  [Testpoint-0.5mm-SMT-withPaste]  (value not drawn)  (no BOM)
TP304  Pad  [Testpoint-0.5mm-SMT-withPaste]  (value not drawn)  (no BOM)
TP305  Pad  [Testpoint-0.5mm-SMT-withPaste]  (value not drawn)  (no BOM)
TP306  Pad  [Testpoint-0.5mm-SMT-withPaste]  (value not drawn)  (no BOM)
TP307  Pad  [Testpoint-0.5mm-SMT-withPaste]  (value not drawn)  (no BOM)
TP308  Pad  [Testpoint-0.5mm-SMT-withPaste]  (value not drawn)  (no BOM)
U300  HSWA2-30DR+  [DG983-1]
U301  GVA-84+  [SOT-89-RF]
U302  LP2985AIM5-3.3  [SOT-23/5]
U303  LT3042HDD#PBF  [DFN50P300X300X80_HS-11N]
U304  LT5537  [DFN-8]
U305  LM8261M5/NOPB  [SOT-23/5]
U306  LP2985AIM5-3.3  [SOT-23/5]
U307  HSWA2-30DR+  [DG983-1]
U308  LT5537  [DFN-8]
U309  LM8261M5/NOPB  [SOT-23/5]
Z300  ADC-15-4+  [ADC-15-4+]
Z301  SBTC-2-10L+  [SBTC-2-10L+]
Z302  SBTC-2-10L+  [SBTC-2-10L+]

### Ports
10MHz_A_CLK_DIV (out), 10MHz_A_IN (in), 10MHz_A_PWR (out), 50MHz_CLK_BUFFER_M1 (out), 50MHz_DIV_M1 (in), 50MHz_M1_IN (in), 50MHz_M1_PWR (out), RSB_A_10MHz_CTL1 (in), RSB_A_10MHz_CTL2 (in), RSB_A_10MHz_OUT (out), RSB_A_50MHZ_CTL1 (in), RSB_A_50MHZ_CTL2 (in)

### Nets
+3V3_RSB_10MHz_A: C328.2 C332.1 C334.1 C341.2 C344.1 C345.2 U306.5(OUT) U307.20(Vdd) U308.1(ENBL) U308.6(VCC) U309.5(V+)
+3V3_RSB_50MHz_M1: C301.1 C303.1 C315.2 C316.2 C326.1 C327.2 U300.20(Vdd) U302.5(OUT) U304.1(ENBL) U304.6(VCC) U305.5(V+)
+5V6_RSB_A: C317.2 C330.2 L307.2 U302.1(VIN) U302.3(ENA) U306.1(VIN) U306.3(ENA)
+5V_50MHz_MMC_M1: C321.2 C322.1 L300.1 U303.9(OUTS) U303.10(VOUT)
GND: C300.2 C301.2 C302.1 C303.2 C309.1 C310.1 C311.1 C312.1 C313.2 C314.2 C315.1 C316.1 C317.1 C318.1 C320.1 C321.1 C322.2 C323.2 C324.1 C325.2 C326.2 C327.1 C328.1 C330.1 C331.1 C332.2 C334.2 C336.2 C337.2 C338.2 C339.2 C340.2 C341.1 C343.1 C344.2 C345.1 M300.0 M301.0 R303.2 R304.2 R305.1 R306.1 R307.2 R308.2 R309.2 R310.2 R311.2 R313.2 R314.1 R315.1 R317.1 R319.2 R320.2 R321.2 R323.2 R325.1 R326.1 R327.2 R328.2 R330.2 R332.2 U300.0(GNDx15) U300.1(GND) U300.2(GND) U300.4(GND) U300.5(GND) U300.6(GND) U300.7(GND) U300.9(GND) U300.10(GND) U300.11(GND) U300.12(GND) U300.14(GND) U300.15(GND) U300.18(GND) U300.19(GND) U301.2 U301.4 U302.2(GND) U303.0(PAD) U303.5(ILIM) U303.8(GND) U304.0(GND) U304.7(GND) U305.2(V-) U306.2(GND) U307.0(GNDx15) U307.1(GND) U307.2(GND) U307.4(GND) U307.5(GND) U307.6(GND) U307.7(GND) U307.9(GND) U307.10(GND) U307.11(GND) U307.12(GND) U307.14(GND) U307.15(GND) U307.18(GND) U307.19(GND) U308.0(GND) U308.7(GND) U309.2(V-) Z300.2(GND) Z301.1(GND) Z301.2(GND) Z302.1(GND) Z302.2(GND)
NetC300_1: C300.1 C302.2 L300.2 L301.2
NetC304_1: C304.1 Z300.1(INPUT)
NetC304_2: C304.2 ; port 50MHz_M1_IN
NetC305_1: C305.1 R300.1 R304.1 TP300.1
NetC305_2: C305.2 U300.3(RF1)
NetC306_1: C306.1 C309.2 L302.1
NetC306_2: C306.2 U300.8(COM)
NetC307_1: C307.1 R301.1 R308.1
NetC307_2: C307.2 U301.1
NetC308_1: C308.1 L301.1 U301.3
NetC308_2: C308.2 R302.2 R309.1
NetC310_2: C310.2 L302.2 L303.1
NetC311_2: C311.2 L303.2 L304.1
NetC312_2: C312.2 L304.2 R301.2 R307.1 TP301.1
NetC313_1: C313.1 L305.1 U300.16(CTRL2)
NetC314_1: C314.1 L306.1 U300.17(CTRL1)
NetC318_2: C318.2 U302.4(BYPASS)
NetC319_1: C319.1 R312.1 R313.1 R315.2 TP302.1
NetC319_2: C319.2 U304.2(IN+)
NetC320_2: C320.2 C325.1 L307.1 U303.1(VIN) U303.2(VIN) U303.3(EN/UV) U303.6(PGFB)
NetC323_1: C323.1 R317.2 U303.7(SET)
NetC324_2: C324.2 U304.3(IN-)
NetC329_1: C329.1 U304.5(CAP-)
NetC329_2: C329.2 U304.4(CAP+)
NetC331_2: C331.2 U306.4(BYPASS)
NetC333_1: C333.1 C338.1 L309.2 TP304.1
NetC333_2: C333.2 U307.13(RF2)
NetC335_1: C335.1 ; port 10MHz_A_IN
NetC335_2: C335.2 Z301.6(SUM_PORT)
NetC336_1: C336.1 L308.1 R318.1 R320.1
NetC337_1: C337.1 L308.2 L309.1
NetC339_1: C339.1 L310.1 U307.16(CTRL2)
NetC340_1: C340.1 L311.1 U307.17(CTRL1)
NetC342_1: C342.1 R324.1 R326.2 R328.1 TP306.1
NetC342_2: C342.2 U308.2(IN+)
NetC343_2: C343.2 U308.3(IN-)
NetC346_1: C346.1 U308.5(CAP-)
NetC346_2: C346.2 U308.4(CAP+)
NetC405_1: RFvia302.1 RFvia303.1 TP305.1 U307.8(COM) ; port RSB_A_10MHz_OUT
NetL305_2: L305.2 ; port RSB_A_50MHZ_CTL2
NetL306_2: L306.2 ; port RSB_A_50MHZ_CTL1
NetL310_2: L310.2 ; port RSB_A_10MHz_CTL2
NetL311_2: L311.2 ; port RSB_A_10MHz_CTL1
NetR300_2: R300.2 R303.1 Z300.6(OUTPUT)
NetR302_1: R302.1 R310.1 RFvia300.1 RFvia301.1 ; port 50MHz_CLK_BUFFER_M1
NetR305_2: R305.2 U300.13(RF2)
NetR306_2: R306.2 Z300.4(50R)
NetR311_1: R311.1 R312.2 Z300.3(COUPLED)
NetR314_2: R314.2 U304.8(OUT) U305.3(IN+)
NetR316_1: R316.1 ; port 50MHz_M1_PWR
NetR316_2: R316.2 TP303.1 U305.1(OUT) U305.4(IN-)
NetR318_2: R318.2 R319.1 Z301.3(PORT_1)
NetR321_1: R321.1 R322.2 Z301.4(PORT_2)
NetR322_1: R322.1 R323.1 Z302.6(SUM_PORT)
NetR324_2: R324.2 R327.1 Z302.3(PORT_1)
NetR325_2: R325.2 U308.8(OUT) U309.3(IN+)
NetR329_1: R329.1 ; port 10MHz_A_PWR
NetR329_2: R329.2 TP307.1 U309.1(OUT) U309.4(IN-)
NetR330_1: R330.1 R331.2 Z302.4(PORT_2)
NetR331_1: R331.1 R332.1 TP308.1 ; port 10MHz_A_CLK_DIV
NetR504_1: U307.3(RF1) ; port 50MHz_DIV_M1

Not connected (* = marked no-connect by the designer): U303 4(PG)*; Z300 5(NC)*; Z301 5(NC)*; Z302 5(NC)*

### Layout directives
net class RF-50R: (no net found under the mark), GND

### Notes on the sheet
- (near C304) -3.5 to +3.5dBm
- -4 to +3dBm
- -4.5 to +2.5dBm
- -6 to +1dBm
- 7.5dB Pad
- +2 to +9dBm
- (near C304) From TX Module
- (GX MODEM)
- To Clock Buffer Input
- (near Z300) IL = -0.5dB
- C = -15dB
- LPF
- Fc = 60MHz
- IL = -1.5dB
- G = 23dB
- 5V @ 108mA
- -18.5 to -11.5dBm
- IL = -0.5dB
- 3V4
- (near R316) Vo = 1.55V @ -3.5dBm
- Vo = 1.69V @ +3.5dBm
- (near C327) Vout(mV) = Slope(mV/dB) x [ Pin(dBm) - Intercept(dBm) ]
  Slope( @ 50 MHz) = 20mV/dB
  Intercept( @ 50MHz) = -96dBm  R = 33k
- Fc = 15MHz
- IL = -0.8dB
- +9.0dBm
- +8.5dBm
- -13dBm Nom
- +9.7dBm
- (near R321) +9.7dBm
- +8.9dBm
- (near RFvia303) To 100MHz PLL Circuit
- (near C335) From CSAC Module
- (near R321) IL = -3.3dB
- +6.4dBm
- -9.6dBm
- Vout(mV) = Slope(mV/dB) x [ Pin(dBm) - Intercept(dBm) ]
  Slope( @ 10 MHz) = 19.6mV/dB
  Intercept( @ 10MHz) = -97dBm  R = 33k
- (near R329) Vo = 1.71V @ 13dBm
- 16dB Pad
- D
- ECO #2434 - No Change to this sheet
- 20MAY25
- SR
- MTL
- B
- C
- Updated switch network, RSB circuit, power supplies.
- No change to this sheet.
- 13SEP22
- 27APR23
- GEN
- DRAWN
- TITLE
- DATE
- REV
- This drawing is proprietary to
- EM Solutions Pty Ltd
- APPROVED
- CHECKED
- PART No.
- FILE
- A3
- DRG No.
- DESCRIPTION
- ACN 082 157 846

### Library data of the parts
C300 C307 C308 C326 C344 = 41-010N-12: as C1036 on sheet 425AK01A_S10; Part Number: 41-010N-12; ItemID: 41-010N-12
C301 C302 C327 C332 C345 = 41-01U0-06: as C201 on sheet 425AK01A_S02; Part Number: 41-01U0-06; ItemID: 41-01U0-06
C303-C306 C313 C314 C318 C321 C331 C333-C335 C339 C340 = 41-010N-12: as C209 on sheet 425AK01A_S02; Part Number: 41-010N-12; ItemID: 41-010N-12
C309 C312 = 41-068P-08: Capacitor, 0402, 68p; Part Number: 41-068P-08
C310 C311 = 41-120P-05: Capacitor, 0402, 120p NPO; Part Number: 41-120P-05
C315 C325 C341 = 41-100N-13: as C200 on sheet 425AK01A_S02; Part Number: 41-100N-13; ItemID: 41-100N-13
C316 C317 C320 C323 C328 C330 = 41-01U0-06: as C1030 on sheet 425AK01A_S10; Part Number: 41-01U0-06; ItemID: 41-01U0-06
C319 C324 C342 C343 = 41-100P-11: Capacitor, 0402, 100p NPO 5% 50V Ceramic, AEC-Q200; MANUFACTURER: TDK; ID: 2448; MODELNAME: CGA2B2C0G1H101J050BA; Part Number: 41-100P-11; ItemID: 41-100P-11
C322 = 41-010U-08: as C1010 on sheet 425AK01A_S10; Part Number: 41-010U-08; ItemID: 41-010U-08
C329 C346 = 41-033N-01: *Capacitor, 0402, 33n, X7R, 10%, 50V; Part Number: 41-033N-01
C336 C338 = 41-300P-01: Capacitor, 0402, 300p NPO 5% 50V Ceramic, NiSn; MANUFACTURER: MURATA; ID: 2478; MODELNAME: GRM1555C1H301JA01D; Part Number: 41-300P-01; ItemID: 41-300P-01
C337 = 41-470P-08: Capacitor, 0402, 470p ,NPO. 5% 50V Ceramic, NiSn; MANUFACTURER: MURATA; ID: 2499; MODELNAME: GRM1555C1H471JA01D; Part Number: 41-470P-08; ItemID: 41-470P-08
GA?#1-GA?#3 = Graphical-Current-Arrow
  GA?#1 GA?#3: X: 13mA
  GA?#2: X: 108mA
L300 = 46-B-11: Solid Inductor, 600ohm@100MHz, DCR=0.52, 0.3A, 0402 size; MANUFACTURER: TDK; ID: 3256; MODELNAME: MMZ1608B301CTAH0; Part Number: 46-B-11; ItemID: 46-B-11
L301 = 46-02U2-01: Inductor, Chip, 2u2H 10%, 0805, SIMID08B Series; MANUFACTURER: SIEMENS; MODELNAME: B82498-B3222-K; Part Number: 46-02U2-01; Category: EMS Parts Master
L302 L304 = 46-200N-04: Inductor, Chip, 200nH, 0402; Part Number: 46-200N-04
L303 = 46-220N-05: Inductor, Chip, 220nH, 0402; Part Number: 46-220N-05
L305-L307 L310 L311 = 46-B-11: as L1006-L1008 on sheet 425AK01A_S10; Part Number: 46-B-11; ItemID: 46-B-11
L308 L309 = 46-680N-02: Inductor, Chip, 680nH, 2%, 0603, 470mA, SRF=260MHz, 0603LS Series; MANUFACTURER: COILCRAFT; ID: 3246; MODELNAME: 0603LS-681XGLB; Part Number: 46-680N-02; ItemID: 46-680N-02
M300 M301 = Can-RF: Part Number: 11-0256
R300 R312 R316 R318 R322 R329 R331 = 44-000R-10: Resistor, 0402, 0R 1% 0.063W; MANUFACTURER: GENERIC; ID: 2538; Part Number: 44-000R-10; ItemID: 44-000R-10; MODELNAME: GENERIC
R301 R302 = 44-047R-10: Resistor, 0402, 47R 1% 0.063W; ID: 2786; Part Number: 44-047R-10; ItemID: 44-047R-10
R303 R304 R311 R313 R319-R321 R323 R330 R332 = 44-N/F-10: as R204 on sheet 425AK01A_S02; Part Number: 44-N/F-10; ItemID: 44-N/F-10
R305 R306 R315 R326 = 44-049R9-10: Resistor, 0402, 49R9 1% 0.063W; ID: 2787; MODELNAME: RC0402FR-0749R9L; Part Number: 44-049R9-10; ItemID: 44-049R9-10
R307-R310 = 44-120R-10: Resistor, 0402, 120R 1% 0.063W; MANUFACTURER: GENERIC; ID: 2950; Part Number: 44-120R-10; ItemID: 44-120R-10; MODELNAME: GENERIC
R314 R325 = 44-033K-10: as R206 on sheet 425AK01A_S02; Part Number: 44-033K-10; ItemID: 44-033K-10
R317 = 44-49K9-01: as R1014 on sheet 425AK01A_S10; Part Number: 44-49K9-01; ItemID: 44-49K9-01
R324 = 44-150R-10: Resistor, 0402, 150R 1% 0.063W; MANUFACTURER: GENERIC; ID: 2966; Part Number: 44-150R-10; ItemID: 44-150R-10; MODELNAME: GENERIC
R327 R328 = 44-068R-10: Resistor, 0402, 68R 1% 0.063W; MANUFACTURER: GENERIC; ID: 2849; Part Number: 44-068R-10; ItemID: 44-068R-10; MODELNAME: GENERIC
RFvia300-RFvia303 = RFvia_L1-L7: RF Via from layer 1 to layer 7, on an 8-layer board.; Rule: UNIONINDEX=0|RULEKIND=PlaneClearance|NETSCOPE=AnyNet|LAYERKIND=SameLayer|NAME=Schematic Power Plane Clearance|CLEARANCE=13.7795mil|UNIT=Imperial
TP300-TP308 = Pad: Pad that can be a test point or a hot via
U300 U307 = HSWA2-30DR+: RF Switch, SPDT, DC-3GHz, Absorptive, IL=1dB, I=60dB, P=30dBm, 2V7-3V3, 4x4 QFN; MANUFACTURER: MINICCTS; ID: 3484; Part Number: 54-30-01; MODELNAME: HSWA2-30DR+; ItemID: 54-30-01
U301 = GVA-84+: MMIC, DC-7GHz, G=24dB, P1dB=20.5dBm, SOT-89; Part Number: 58-GVA84-01
U302 U306 = Regulator-Linear-3V3-LP2985: as U1003 on sheet 425AK01A_S10
U303 = 52-3042-01: as U1002 on sheet 425AK01A_S10; Part Number: 52-3042-01; ItemID: 52-3042-01
U304 U308 = LT5537EDDB: RF Detector, 10-1000MHz, 83dB, -40/+85C, 8-DFN 3x2mm; Part Number: 54-5537-01; MPN: LT5537EDDB
U305 U309 = OpAmp-LM8261: Opamp, RRIO, 2V5 to 30V supply, 21MHz GBWP; Part Number: 52-8621-01
Z300 = 33-0058: Directional Coupler, C=15.5dB, 5-1000MHz, SM; MANUFACTURER: MINICCTS; ID: 2077; Part Number: 33-0058; MODELNAME: ADC-15-4+; ItemID: 33-0058
Z301 Z302 = 33-0055: Divider/Combiner, 2 Way, 0 deg, 10 -1000MHz, Tx Line Tranformer; MANUFACTURER: MINICCTS; ID: 2075; Part Number: 33-0055; ItemID: 33-0055; MODELNAME: SBTC-2-10L+